# Altium schematic sheet Connectors.SchDoc
size A4
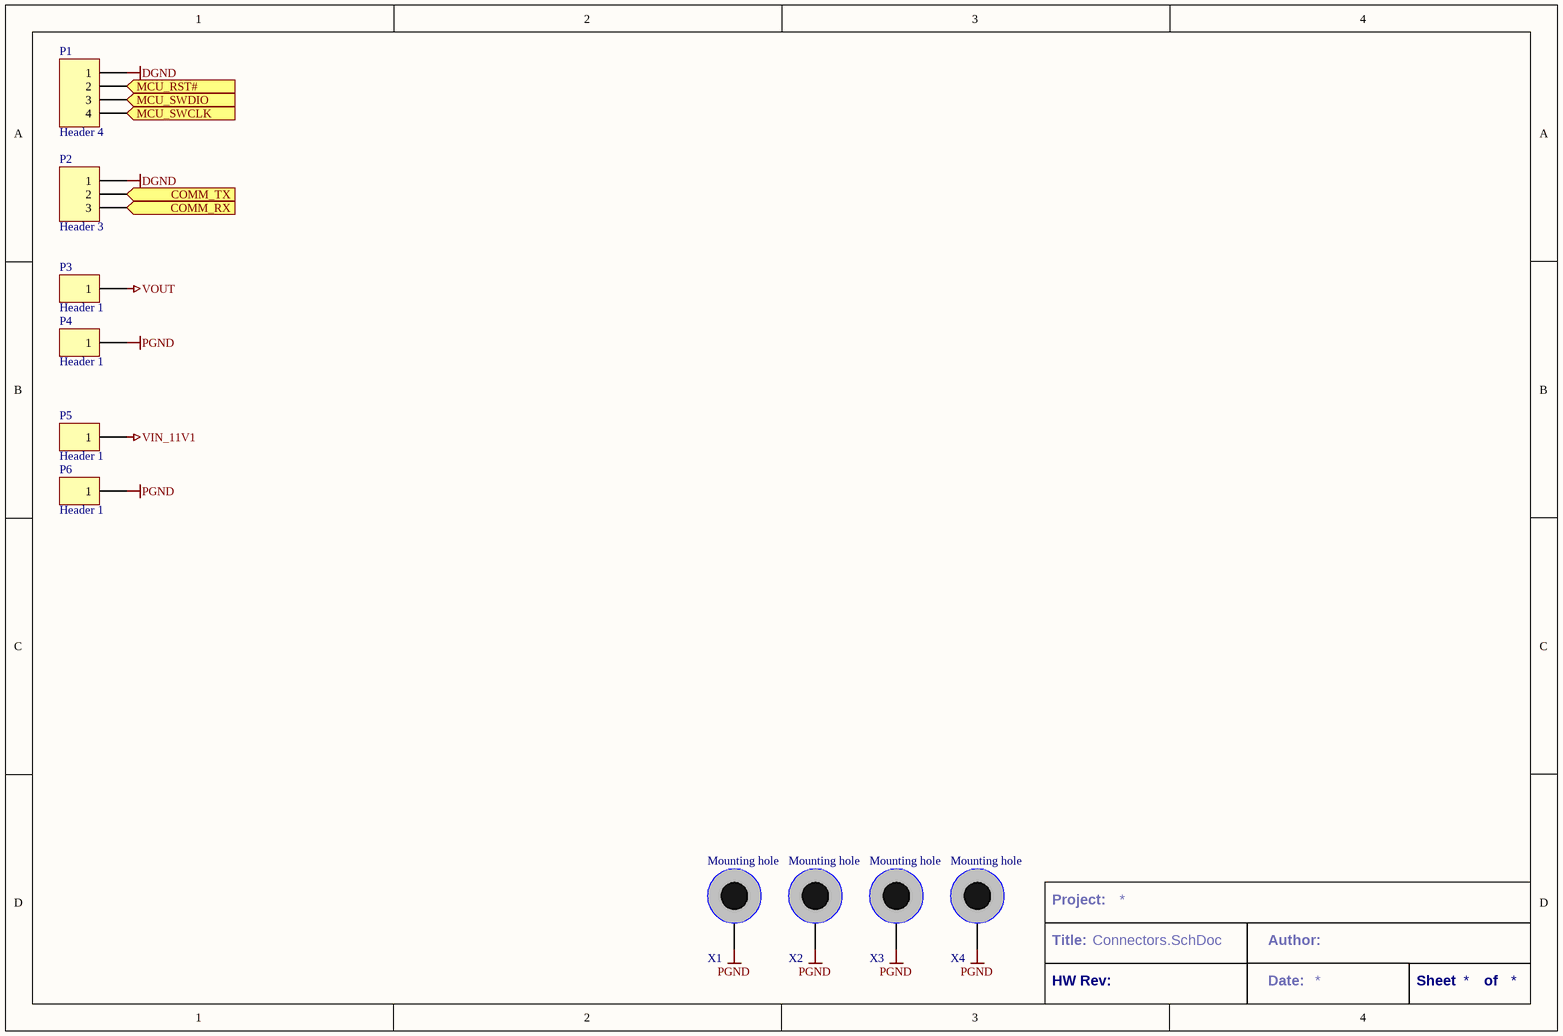
[diagram p0: Connectors.SchDoc]

## Parts
P1  Header 4  [HDR_SMD_1X4_1.50]
P2  Header 3  [HDR_SMD_1X3_1.50]
P3  Header 1  [WIRE_SMD_5X5]
P4  Header 1  [WIRE_SMD_5X5]
P5  Header 1  [WIRE_SMD_5X5]
P6  Header 1  [WIRE_SMD_5X5]
X1  Mounting hole  [HOLE_M3_D6.0/3.5]  (no BOM)
X2  Mounting hole  [HOLE_M3_D6.0/3.5]  (no BOM)
X3  Mounting hole  [HOLE_M3_D6.0/3.5]  (no BOM)
X4  Mounting hole  [HOLE_M3_D6.0/3.5]  (no BOM)

## Ports
COMM_RX, COMM_TX, MCU_RST#, MCU_SWCLK, MCU_SWDIO

## Nets
DGND: P1.1 P2.1
PGND: P4.1 P6.1 X1.1 X2.1 X3.1 X4.1
VIN_11V1: P5.1
VOUT: P3.1
COMM_RX: P2.3 ; port COMM_RX
COMM_TX: P2.2 ; port COMM_TX
MCU_RST#: P1.2 ; port MCU_RST#
MCU_SWCLK: P1.4 ; port MCU_SWCLK
MCU_SWDIO: P1.3 ; port MCU_SWDIO

## Notes on the sheet
- Project:
- Title:
- HW Rev:
- Author:
- Date:
- Sheet
- of

## Library data of the parts
P1 = Header 4: Header, 4-Pin; LatestRevisionDate: 17-Jul-2002; LatestRevisionNote: Re-released for DXP Platform.; Publisher: Altium Limited
P2 = Header 3: Header, 3-Pin; LatestRevisionDate: 17-Jul-2002; LatestRevisionNote: Re-released for DXP Platform.; Publisher: Altium Limited
P3-P6 = Header 1: Header, 1-Pin; LatestRevisionDate: 17-Jul-2002; LatestRevisionNote: Re-released for DXP Platform.; Publisher: Altium Limited
X1-X4 = Mounting hole: Hole for screw M3, outline D6